# EAGLE design accelerometer-daughterboard (EAGLE 9.6.2)
REV: A
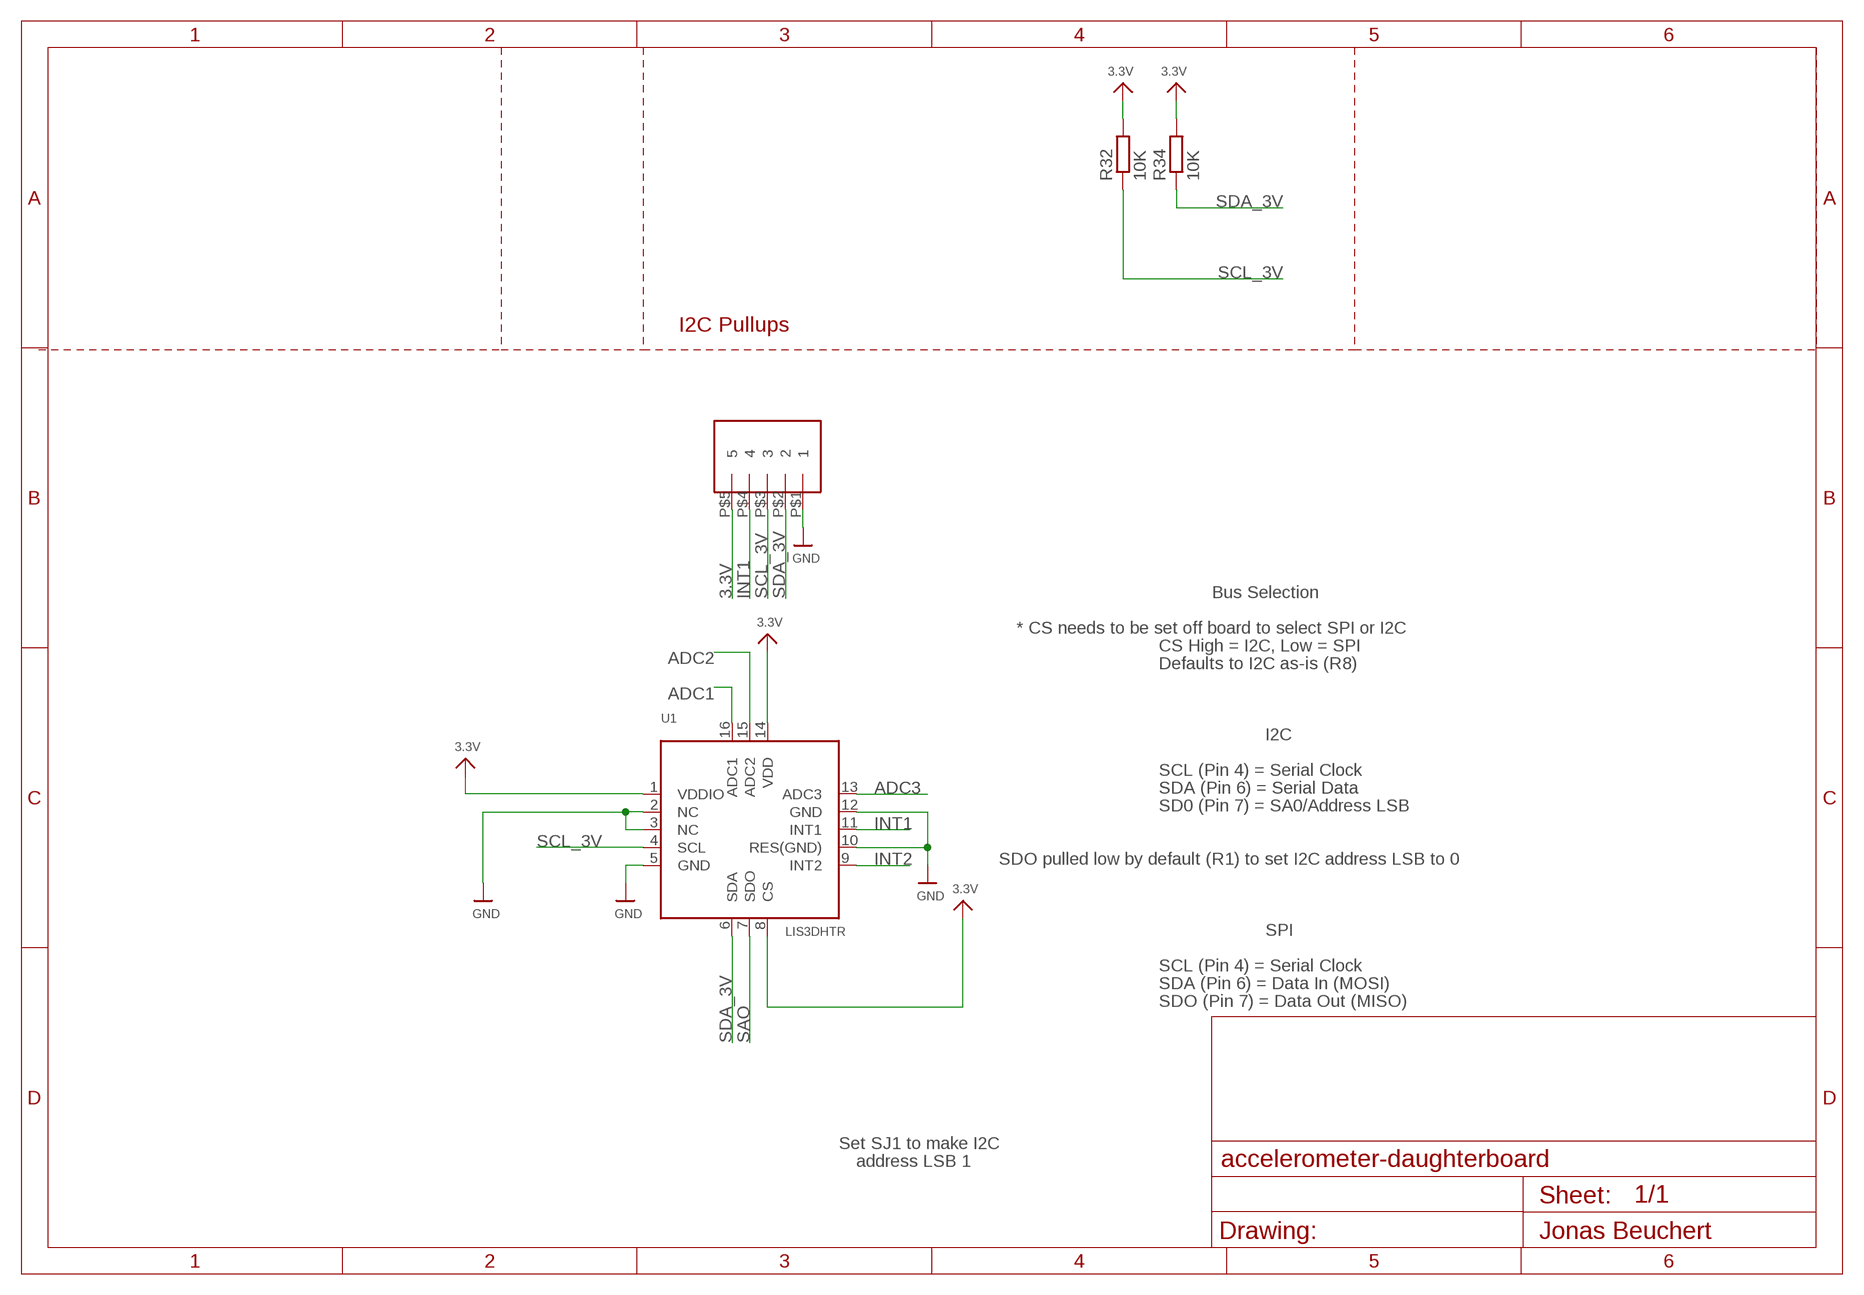
[diagram p0: schematic, sheet 1]

## Parts
R32  10K  R-EU_R0603  [R0603]
R34  10K  R-EU_R0603  [R0603]
U1  LIS3DHTR  ACCEL_LIS3DHTR  [LGA16_3X3MM]
U$1  ALEX_CONN5  [ALEX_CONN5]

## Nets
3.3V [lowpower]: R32.2 R34.2 U1.1(VDDIO) U1.8(CS) U1.14(VDD) U$1.P$5
ADC1: U1.16(ADC1)
ADC2: U1.15(ADC2)
ADC3: U1.13(ADC3)
GND [highpower]: U1.2(NC) U1.3(NC) U1.5(GND) U1.10(RES(GND)) U1.12(GND) U$1.P$1
INT1: U1.11(INT1) U$1.P$4
INT2: U1.9(INT2)
SAO: U1.7(SDO)
SCL_3V: R32.1 U1.4(SCL) U$1.P$3
SDA_3V: R34.1 U1.6(SDA) U$1.P$2

## Notes on the sheet
- I2C Pullups
- Bus Selection
- * CS needs to be set off board to select SPI or I2C
- CS High = I2C, Low = SPI
- Defaults to I2C as-is (R8)
- I2C
- SCL (Pin 4) = Serial Clock
- SDA (Pin 6) = Serial Data
- SD0 (Pin 7) = SA0/Address LSB
- SDO pulled low by default (R1) to set I2C address LSB to 0
- SPI
- SCL (Pin 4) = Serial Clock
- SDA (Pin 6) = Data In (MOSI)
- SDO (Pin 7) = Data Out (MISO)
- Set SJ1 to make I2C
- address LSB 1

## Library data of the parts
R32 R34 = rcl:R-EU_: RESISTOR, European symbol; SPICEPREFIX: R
U1 = microbuilder:ACCEL_LIS3DHTR: LIS3DHTR 3-Axis Accelerometer with I2C/SPI Interface VDD: 1.71-3.6V VDDIO: 1.71-VDD+0.1V Scale: +/-2g, 4g, 8g, 16g with 16--bit data output Temp:: -40°C - 85°C Mouser: 511-LIS3DHTR Digikey: 497-10613-1-ND
U$1 = TestBoard_2_2_LiPo:ALEX_CONN5

## Net classes
1 highpower: width 0.406 mm, drill 0.483 mm
2 lowpower: width 0.305 mm, drill 0.483 mm

## Board
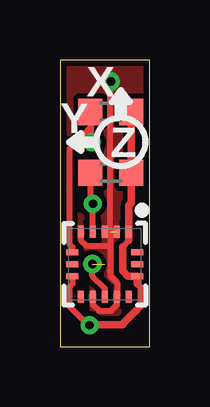
[diagram p1: board, top side]
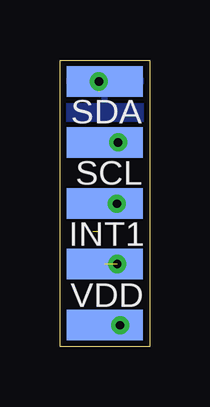
[diagram p2: board, bottom side, seen from below]

Size 3.74 x 11.94 mm. Coordinates in mm from the lower left corner, seen from the top.
Outline: 0,0 3.74,0 3.74,11.94 0,11.94 0,0
Copper layers (1*16): Top 0.035mm / dielectric 1.5mm / Bottom 0.035mm
Design rules "adafruit *": minimum track width 8mil, minimum drill 15.5mil, track to track 8mil, track to pad 8mil, pad to pad 8mil, via to via 8mil, smd to smd 8mil, copper to edge 10mil, drill to drill 8mil, minimum pad ring 10mil, minimum via ring 8mil, stop-mask expansion 2mil, vias tented up to drill 20mil, thermal gap 10mil

### Footprints (pad centres in the part's own frame; a part is rotated, then mirrored left to right if it is on the bottom)
R0603 = smd 1 x 1.1: 1 -0.85,0; 2 0.85,0
LGA16_3X3MM = smd 0.5 x 0.25: 1 -1.35,1; 2 -1.35,0.5; 3 -1.35,0; 4 -1.35,-0.5; 5 -1.35,-1; 9 1.35,-1; 10 1.35,-0.5; 11 1.35,0; 12 1.35,0.5; 13 1.35,1 | smd 0.25 x 0.5: 6 -0.5,-1.35; 7 0,-1.35; 8 0.5,-1.35; 14 0.5,1.35; 15 0,1.35; 16 -0.5,1.35
ALEX_CONN5 = smd 3.175 x 1.27: P$1 0,5.08; P$2 0,2.54; P$3 0,0; P$4 0,-2.54; P$5 0,-5.08

### Placement (x,y rotation side)
R32  2.12,7.24 0 top
R34  2.12,9.78 0 top
U1  1.87,3.43 270 top
U$1  1.87,5.97 0 bottom

### Tracks (layer width: path | path; a pad name or v marks a point on that pad's centre or on a via)
3.3V  (via drill 0.35)
  Top 0.254: 2.61,4.17 2.87,4.43 | U1.8 0.52,2.61 0.39,2.48 0.39,1.68 1.16,0.92 | 3.22,2.61 3.35,2.48 3.35,1.65 3.21,1.51 2.62,0.92
  Top 0.305: 2.61,4.17 2.61,3.15 2.82,2.93 U1.14 3.22,2.61 | 2.87,4.43 U1.1 2.87,5.89 2.97,5.99 R32.2 R34.2 | v1.24,0.89 1.21,0.92 1.16,0.92 | v1.24,0.89 1.26,0.92 2.62,0.92 | 3.21,1.51 3.17,1.51 2.58,0.91 1.26,0.91 v1.24,0.89
  Bottom 0.406: U$1.P$5 v1.24,0.89
GND  (via drill 0.35)  (2 unrouted)
  Top 0.254: U1.2 2.1,4.78 | 2.08,4.78 U1.3 | 2.1,4.78 2.1,4.2 | 2.1,4.2 2.1,3.18 | 2.1,3.18 2.1,2.94 2.38,2.66 U1.12 2.37,1.73 2.12,1.48 1.62,1.48 1.37,1.74 U1.10 | 2.1,3.18 2.08,3.16 2.08,3.14 | 2.1,4.78 2.1,10.61 | v2.12,11.05 2.1,11.03 2.1,10.63 | U1.5 0.87,4.44 1.11,4.2 2.1,4.2
  Bottom 0.406: U$1.P$1 v2.12,11.05
  pour Top: -7.02,-9.27 -7.02,16.13 10.76,16.13 10.76,-9.27
  pour Bottom: -7.02,-9.27 -7.02,16.13 10.76,16.13 10.76,-9.27
INT1  (via drill 0.35)  (1 unrouted)
  Top 0.254: U1.11 1.87,2.43 1.35,2.94 v1.35,3.44
SCL_3V  (via drill 0.35)
  Top 0.254: v1.37,5.95 | U1.4 v1.37,5.95 | R32.1 1.27,6.05 v1.37,5.95
  Bottom 0.406: U$1.P$3 1.85,5.95 v1.37,5.95
SDA_3V  (via drill 0.35)
  Top 0.254: U1.6 0.52,4.14 0.41,4.25 0.41,8.26 0.66,8.51 | 0.66,8.51 1.28,9.13 | 1.28,9.13 R34.1 | 0.66,8.51 v1.32,8.51 1.28,8.55 1.28,9.13
  Bottom 0.406: U$1.P$2 v1.32,8.51

### Text on the board
tPlace: X | Y | Z
bPlace: SDA | SCL | INT1 | VDD